# Altium schematic sheet Parallel Output.SchDoc
size A4
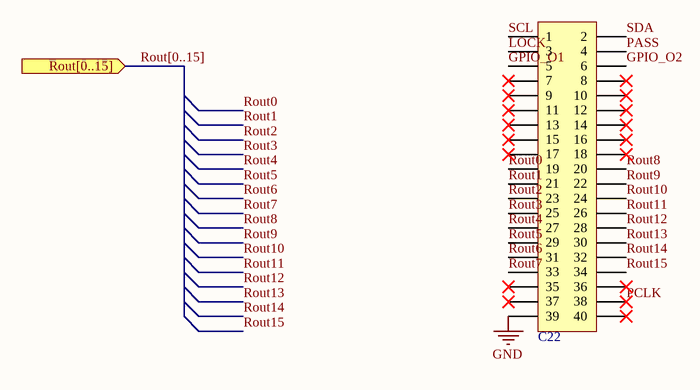
[diagram p0: Parallel Output.SchDoc]

## Parts
C22  WE-2,54mm_Box Header 61204020621  [61204020621]  (value not drawn)

## Ports
Rout[0..15] (in)

## Nets
GND: C22.39
GPIO_O1: C22.5
GPIO_O2: C22.6
LOCK: C22.3
PASS: C22.4
PCLK: C22.38
Rout0: C22.19
Rout1: C22.21
Rout2: C22.23
Rout3: C22.25
Rout4: C22.27
Rout5: C22.29
Rout6: C22.31
Rout7: C22.33
Rout8: C22.20
Rout9: C22.22
Rout10: C22.24
Rout11: C22.26
Rout12: C22.28
Rout13: C22.30
Rout14: C22.32
Rout15: C22.34
SCL: C22.1
SDA: C22.2

Not connected (* = marked no-connect by the designer): C22 7* 8* 9* 10* 11* 12* 13* 14* 15* 16* 17* 18* 35* 36* 37* 40*

## Buses and harness runs
bus Rout[0..15] = port Rout[0..15]

## Library data of the parts
C22 = WE-2,54mm_Box Header 61204020621: WR-BHD 2.54mm Male SMT Box Header; Manufacturer: W¨¹rth Elektronik eiSos GmbH; ComponentLink1 Description: Manufacturer; ComponentLink2 Description: Datasheet; NoPins: 40; Created Date: 8 May 2013; partNo: 61204020621; ComponentLink1URL: http://www.we-online.com; ComponentLink2URL: http://katalog.we-online.de/em/datasheet/6120xx20621.pdf; Created by: Karrer Zheng